# EAGLE design v1 (EAGLE 9.4.1)
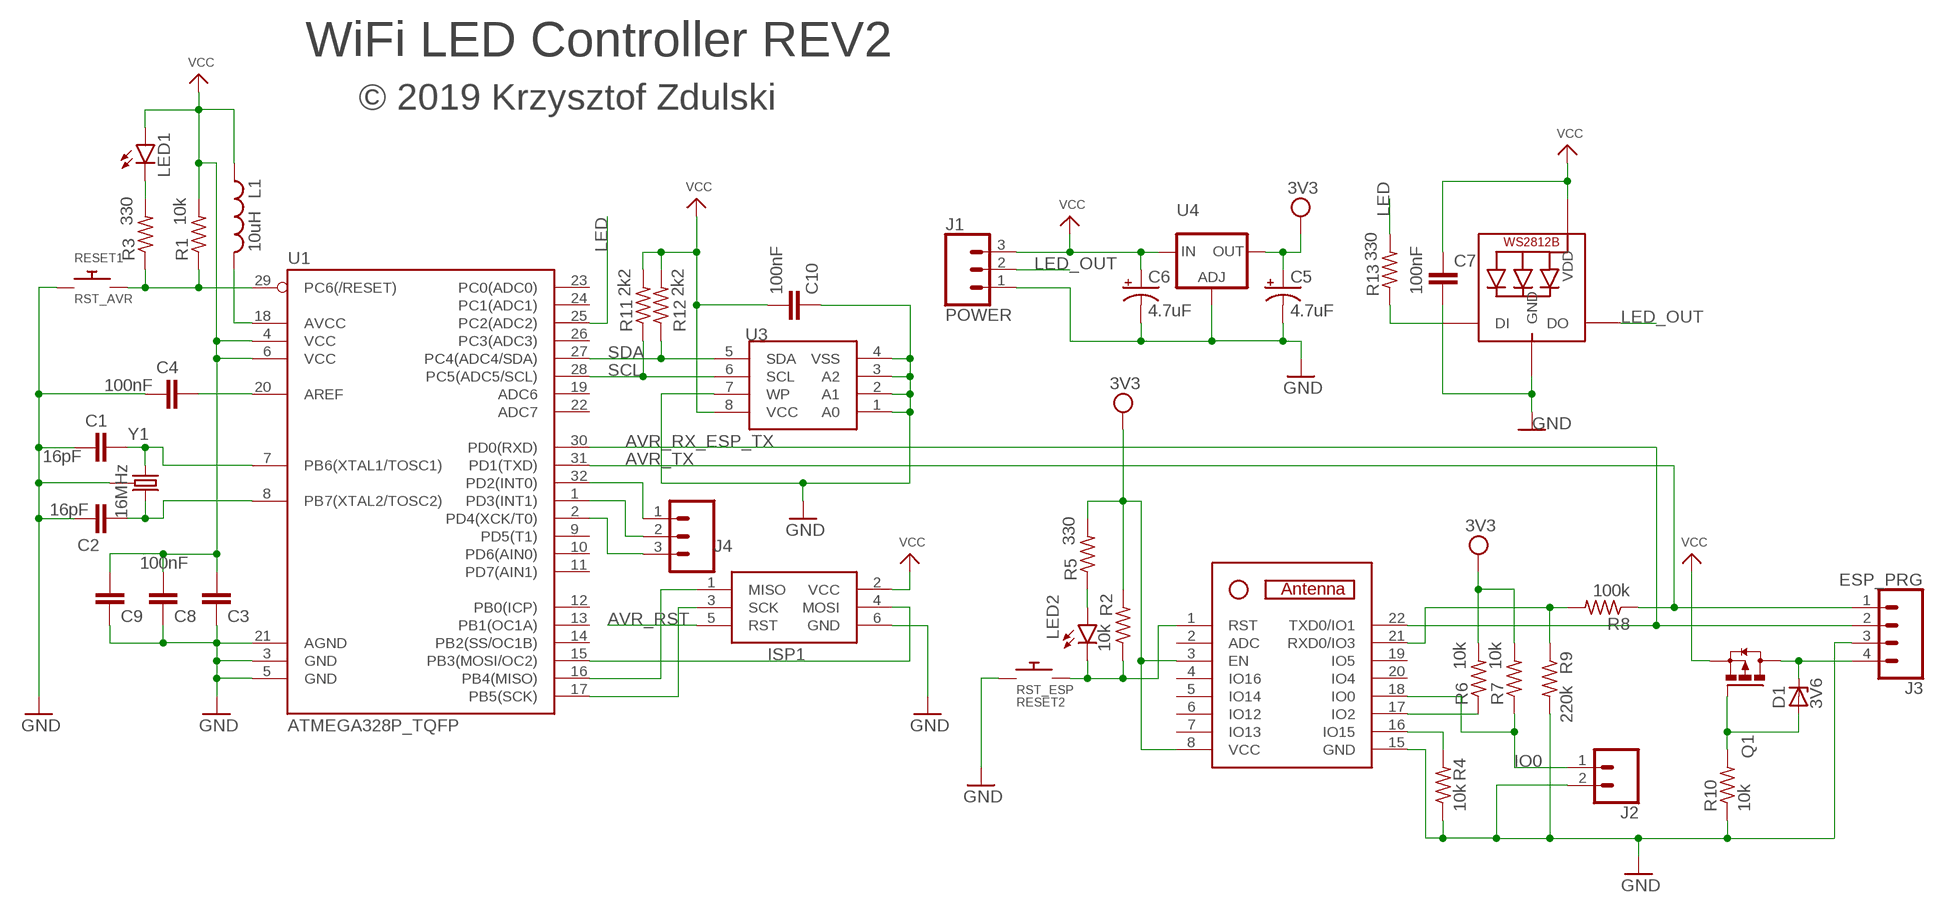
[diagram p0: schematic, sheet 1]

## Parts
C1  16pF  C-EUC0603K  [C0603K]
C2  16pF  C-EUC0603K  [C0603K]
C3  100nF  C-EUC0603  [C0603]
C4  100nF  C-EUC0603  [C0603]
C5  4.7uF  CPOL-US153CLV-0405  [153CLV-0405]
C6  4.7uF  CPOL-US153CLV-0405  [153CLV-0405]
C7  100nF  C-EUC0603  [C0603]
C8  100nF  C-EUC0603  [C0603]
C9  100nF  C-EUC0603  [C0603]
C10  100nF  C-EUC0603  [C0603]
D1  3V6  ZENNER_DIODE  [SOD123]
D2  WS2812B  [WS2812B]
ISP1  AVRISP-6  [AVRISP]
J1  POWER  MX-22-05-3031  [MX-22-05-3031]
J2  CONN_02  [1X02]
J3  ESP_PRG  CONN_04  [1X04]
J4  CONN_03  [1X03]
L1  10uH  L-USL2012C  [L2012C]
LED1  LEDCHIP-LED0603  [CHIP-LED0603]
LED2  LEDCHIP-LED0603  [CHIP-LED0603]
Q1  FDN360P  [SUPER-SOT3]
R1  10k  R-US_R0402  [R0402]
R2  10k  R-US_R0402  [R0402]
R3  330  R-US_R0603  [R0603]
R4  10k  R-US_R0603  [R0603]
R5  330  R-US_R0603  [R0603]
R6  10k  R-US_R0603  [R0603]
R7  10k  R-US_R0603  [R0603]
R8  100k  R-US_R0603  [R0603]
R9  220k  R-US_R0603  [R0603]
R10  10k  R-US_R0402  [R0402]
R11  2k2  R-US_R0603  [R0603]
R12  2k2  R-US_R0603  [R0603]
R13  330  R-US_R0603  [R0603]
RESET1  RST_AVR  BUTTON  [TACTILE_SWITCH_SMD_6.2MM_TALL]
RESET2  RST_ESP  BUTTON  [TACTILE_SWITCH_SMD_6.2MM_TALL]
U1  ATMEGA328P_TQFP  [TQFP32-08]
U2  ESP-07  [ESP-07]
U3  EEPROM-I2CTSSOP8  [TSSOP8]
U4  LD117AS12TR  [SOT223]
Y1  16MHz  CRYSTAL  [CRYSTAL-SMD-3.2X2.5MM]

## Nets
3V3: C5.+ R2.2 R5.2 R6.2 R7.2 U2.3(EN) U2.8(VCC) U4.4(OUT)
AREF: C4.2 U1.20(AREF)
AVCC: L1.2 U1.18(AVCC)
AVR_RST: ISP1.5(RST) R1.1 R3.1 RESET1.B1 RESET1.B2 U1.29(PC6(/RESET))
AVR_RST_LED: LED1.C R3.2
AVR_RX_ESP_TX: J3.2 U1.30(PD0(RXD)) U2.22(TXD0/IO1)
AVR_TX: J3.1 R8.1 U1.31(PD1(TXD))
ESP_RST: LED2.C R2.1 RESET2.B1 RESET2.B2 U2.1(RST)
ESP_RX: R8.2 R9.1 U2.21(RXD0/IO3)
GND: C1.2 C2.2 C3.2 C4.1 C5.- C6.- C7.2 C8.2 C9.2 C10.2 D2.3-GND(GND) ISP1.6(GND) J1.1 J2.2 J3.3 R4.1 R9.2 R10.1 RESET1.A1 RESET1.A2 RESET2.A1 RESET2.A2 U1.3(GND) U1.5(GND) U1.21(AGND) U2.15(GND) U3.1(A0) U3.2(A1) U3.3(A2) U3.4(VSS) U3.7(WP) U4.1(ADJ) Y1.2 Y1.4
IO0: J2.1 R7.1 U2.18(IO0)
IO2: R6.1 U2.17(IO2)
IO15: R4.2 U2.16(IO15)
LED: R13.2 U1.25(PC2(ADC2))
LED_OUT: D2.2-DOUT(DO) J1.2
MISO: ISP1.1(MISO) U1.16(PB4(MISO))
MOSI: ISP1.4(MOSI) U1.15(PB3(MOSI/OC2))
N: D2.4-DIN(DI) R13.1
N$1: LED2.A R5.1
N$18: D1.A Q1.1(G) R10.2
PD2: J4.1 U1.32(PD2(INT0))
PD3: J4.2 U1.1(PD3(INT1))
PD4: J4.3 U1.2(PD4(XCK/T0))
SCK: ISP1.3(SCK) U1.17(PB5(SCK))
SCL: R11.1 U1.28(PC5(ADC5/SCL)) U3.6(SCL)
SDA: R12.1 U1.27(PC4(ADC4/SDA)) U3.5(SDA)
VCC: C3.1 C6.+ C7.1 C8.1 C9.1 C10.1 D2.1-VDD(VDD) ISP1.2(VCC) J1.3 L1.1 LED1.A Q1.2(S) R1.2 R11.2 R12.2 U1.4(VCC) U1.6(VCC) U3.8(VCC) U4.3(IN)
VCC_PRG: D1.C J3.4 Q1.3(D)
XTAL1: C1.1 U1.7(PB6(XTAL1/TOSC1)) Y1.1
XTAL2: C2.1 U1.8(PB7(XTAL2/TOSC2)) Y1.3
Unconnected: U1.9(PD5(T1)) U1.10(PD6(AIN0)) U1.11(PD7(AIN1)) U1.12(PB0(ICP)) U1.13(PB1(OC1A)) U1.14(PB2(SS/OC1B)) U1.19(ADC6) U1.22(ADC7) U1.23(PC0(ADC0)) U1.24(PC1(ADC1)) U1.26(PC3(ADC3)) U2.2(ADC) U2.4(IO16) U2.5(IO14) U2.6(IO12) U2.7(IO13) U2.19(IO5) U2.20(IO4)

## Notes on the sheet
- WiFi LED Controller REV2
- © 2019 Krzysztof Zdulski

## Library data of the parts
C1-C4 C7-C10 = resistor:C-EU: CAPACITOR, European symbol
C5 C6 = resistor:CPOL-US: POLARIZED CAPACITOR, American symbol
D1 = my_parts:ZENNER_DIODE
D2 = my_parts:WS2812B
ISP1 = my_parts:AVRISP: AVR ISP HEADER Standard 6 pin header for AVR programming
J1 = my_parts:MX-22-05-3031
J2 = SparkFun-Connectors:CONN_02: Multi connection point. Often used as Generic Header-pin footprint for 0.1 inch spaced/style header connections On any of the 0.1 inch spaced packages, you can populate with these: Break Away Headers - Straight <https://www.sparkfun.com/products/116> (PRT-00116) Break Away Male Headers - Right Angle <https://www.sparkfun.com/products/553> (PRT-00553) Female Headers <https://www.sparkfun.com/products/115> (PRT-00115) Break Away Headers - Machine Pin <https://www.sparkfun.com/products/117> (PRT-00117) Break Away Female Headers - Swiss Machine Pin <https://www.sparkfun.com/products/743> (PRT-00743) For SCREWTERMINALS and SPRING TERMINALS visit here: Screw Terimnals on SparkFun.com <https://www.sparkfun.com/search/results?term=Screw+Terminals> (5mm/3.5mm/2.54mm spacing) This device is also useful as a general connection point to wire up your design to another part of your project. Our various solder wires solder well into these plated through hole pads. Hook-Up Wire - Assortment (Stranded, 22 AWG) <https://www.sparkfun.com/products/11375> (PRT-11375) Hook-Up Wire - Assortment (Solid Core, 22 AWG) <https://www.sparkfun.com/products/11367> (PRT-11367) View the entire wire category on our website here <https://www.sparkfun.com/categories/141> Special notes: Molex polarized connector foot print use with: PRT-08233 with associated crimp pins and housings. 2.54_SCREWTERM for use with PRT-10571. 3.5mm Screw Terminal footprints for PRT-08084 5mm Screw Terminal footprints for use with PRT-08432
J3 = SparkFun-Connectors:CONN_04: Multi connection point. Often used as Generic Header-pin footprint for 0.1 inch spaced/style header connections On any of the 0.1 inch spaced packages, you can populate with these: Break Away Headers - Straight <https://www.sparkfun.com/products/116> (PRT-00116) Break Away Male Headers - Right Angle <https://www.sparkfun.com/products/553> (PRT-00553) Female Headers <https://www.sparkfun.com/products/115> (PRT-00115) Break Away Headers - Machine Pin <https://www.sparkfun.com/products/117> (PRT-00117) Break Away Female Headers - Swiss Machine Pin <https://www.sparkfun.com/products/743> (PRT-00743) For SCREWTERMINALS and SPRING TERMINALS visit here: Screw Terimnals on SparkFun.com <https://www.sparkfun.com/search/results?term=Screw+Terminals> (5mm/3.5mm/2.54mm spacing) This device is also useful as a general connection point to wire up your design to another part of your project. Our various solder wires solder well into these plated through hole pads. Hook-Up Wire - Assortment (Stranded, 22 AWG) <https://www.sparkfun.com/products/11375> (PRT-11375) Hook-Up Wire - Assortment (Solid Core, 22 AWG) <https://www.sparkfun.com/products/11367> (PRT-11367) View the entire wire category on our website here <https://www.sparkfun.com/categories/141> Special notes: Molex polarized connector foot print use with SKU : PRT-08231 with associated crimp pins and housings. 1MM SMD Version SKU: PRT-10208; PROD_ID: CONN-09696
J4 = SparkFun-Connectors:CONN_03: Multi connection point. Often used as Generic Header-pin footprint for 0.1 inch spaced/style header connections On any of the 0.1 inch spaced packages, you can populate with these: Break Away Headers - Straight <https://www.sparkfun.com/products/116> (PRT-00116) Break Away Male Headers - Right Angle <https://www.sparkfun.com/products/553> (PRT-00553) Female Headers <https://www.sparkfun.com/products/115> (PRT-00115) Break Away Headers - Machine Pin <https://www.sparkfun.com/products/117> (PRT-00117) Break Away Female Headers - Swiss Machine Pin <https://www.sparkfun.com/products/743> (PRT-00743) Stackable Header - 3 Pin (Female, 0.1") <https://www.sparkfun.com/products/13875> (PRT-13875) For SCREWTERMINALS and SPRING TERMINALS visit here: Screw Terimnals on SparkFun.com <https://www.sparkfun.com/search/results?term=Screw+Terminals> (5mm/3.5mm/2.54mm spacing) This device is also useful as a general connection point to wire up your design to another part of your project. Our various solder wires solder well into these plated through hole pads. Hook-Up Wire - Assortment (Stranded, 22 AWG) <https://www.sparkfun.com/products/11375> (PRT-11375) Hook-Up Wire - Assortment (Solid Core, 22 AWG) <https://www.sparkfun.com/products/11367> (PRT-11367) View the entire wire category on our website here <https://www.sparkfun.com/categories/141> Special notes: Molex polarized connector foot print use with SKU : PRT-08232 with associated crimp pins and housings.
L1 = resistor:L-US: INDUCTOR, American symbol
LED1 LED2 = led:LED: LED OSRAM: - CHIPLED LG R971, LG N971, LY N971, LG Q971, LY Q971, LO R971, LY R971 LH N974, LH R974 LS Q976, LO Q976, LY Q976 LO Q996 - Hyper CHIPLED LW Q18S LB Q993, LB Q99A, LB R99A - SideLED LS A670, LO A670, LY A670, LG A670, LP A670 LB A673, LV A673, LT A673, LW A673 LH A674 LY A675 LS A676, LA A676, LO A676, LY A676, LW A676 LS A679, LY A679, LG A679 - Hyper Micro SIDELED® LS Y876, LA Y876, LO Y876, LY Y876 LT Y87S - SmartLED LW L88C, LW L88S LB L89C, LB L89S, LG L890 LS L89K, LO L89K, LY L89K LS L896, LA L896, LO L896, LY L896 - TOPLED LS T670, LO T670, LY T670, LG T670, LP T670 LSG T670, LSP T670, LSY T670, LOP T670, LYG T670 LG T671, LOG T671, LSG T671 LB T673, LV T673, LT T673, LW T673 LH T674 LS T676, LA T676, LO T676, LY T676, LB T676, LH T676, LSB T676, LW T676 LB T67C, LV T67C, LT T67C, LS T67K, LO T67K, LY T67K, LW E67C LS E67B, LA E67B, LO E67B, LY E67B, LB E67C, LV E67C, LT E67C LW T67C LS T679, LY T679, LG T679 LS T770, LO T770, LY T770, LG T770, LP T770 LB T773, LV T773, LT T773, LW T773 LH T774 LS E675, LA E675, LY E675, LS T675 LS T776, LA T776, LO T776, LY T776, LB T776 LHGB T686 LT T68C, LB T68C - Hyper Mini TOPLED® LB M676 - Mini TOPLED Santana® LG M470 LS M47K, LO M47K, LY M47K Source: http://www.osram.convergy.de LUXEON: - LUMILED® LXK2-PW12-R00, LXK2-PW12-S00, LXK2-PW14-U00, LXK2-PW14-V00 LXK2-PM12-R00, LXK2-PM12-S00, LXK2-PM14-U00 LXK2-PE12-Q00, LXK2-PE12-R00, LXK2-PE12-S00, LXK2-PE14-T00, LXK2-PE14-U00 LXK2-PB12-K00, LXK2-PB12-L00, LXK2-PB12-M00, LXK2-PB14-N00, LXK2-PB14-P00, LXK2-PB14-Q00 LXK2-PR12-L00, LXK2-PR12-M00, LXK2-PR14-Q00, LXK2-PR14-R00 LXK2-PD12-Q00, LXK2-PD12-R00, LXK2-PD12-S00 LXK2-PH12-R00, LXK2-PH12-S00 LXK2-PL12-P00, LXK2-PL12-Q00, LXK2-PL12-R00 Source: www.luxeon.com KINGBRIGHT: KA-3528ASYC Source: www.kingbright.com
Q1 = transistor-power:FDN360P: Single P-Channel, PowerTrench (R) MOSFET Source: http://www.fairchildsemi.com/ds/FD/FDN360P.pdf
R1-R13 = resistor:R-US_: RESISTOR, American symbol
RESET1 RESET2 = my_parts:BUTTON
U1 = SparkFun-IC-Microcontroller:ATMEGA328P_TQFP: Popular 328P in QFP Storefront component: ATmega328 - TQFP <https://www.sparkfun.com/products/13448> (COM-13448) Datasheet <http://www.sparkfun.com/datasheets/Components/SMD/ATMega328.pdf> SparkFun Products SparkFun RedBoard - Programmed with Arduino <https://www.sparkfun.com/products/12757> (DEV-12757) Arduino Pro Mini 328 - 5V/16MHz <https://www.sparkfun.com/products/11113> (DEV-11113) Arduino Pro Mini 328 - 3.3V/8MHz <https://www.sparkfun.com/products/11114> (DEV-11114) SparkFun OpenLog <https://www.sparkfun.com/products/13712> (DEV-13712) SparkFun MicroView - OLED Arduino Module <https://www.sparkfun.com/products/12923> (DEV-12923) SparkFun Digital Sandbox <https://www.sparkfun.com/products/12651> (DEV-12651) SparkFun PicoBoard <https://www.sparkfun.com/products/11888> (WIG-11888) Arduino Fio <https://www.sparkfun.com/products/10116> (DEV-10116) LilyPad Arduino 328 Main Board <https://www.sparkfun.com/products/13342> (DEV-13342) SparkFun RedStick <https://www.sparkfun.com/products/13741> (DEV-13741) LilyPad MP3 <https://www.sparkfun.com/products/11013> (DEV-11013) LilyPad Arduino SimpleSnap <https://www.sparkfun.com/products/10941> (DEV-10941) SparkFun Stepoko <https://www.sparkfun.com/products/13899> (ROB-13899) SparkFun Geiger Counter <https://www.sparkfun.com/products/11345> (SEN-11345) SparkFun EL Sequencer <https://www.sparkfun.com/products/12781> (COM-12781) Arduino Pro 328 - 5V/16MHz <https://www.sparkfun.com/products/10915> (DEV-10915) CryptoCape <https://www.sparkfun.com/products/12773> (DEV-12773) SparkFun IR Thermometer Evaluation Board - MLX90614 <https://www.sparkfun.com/products/10740> (SEN-10740) SparkFun RedBot Mainboard <https://www.sparkfun.com/products/12097> (ROB-12097) Arduino Pro 328 - 3.3V/8MHz <https://www.sparkfun.com/products/10914> (DEV-10914) SparkFun Block for Intel® Edison - Arduino <https://www.sparkfun.com/products/13036> (DEV-13036) SparkFun Simon Says - Surface Mount Soldering Kit <https://www.sparkfun.com/products/10935> (KIT-10935) SparkFun 7-Segment Serial Display - Red <https://www.sparkfun.com/products/11441> (COM-11441) SparkFun 7-Segment Serial Display - White <https://www.sparkfun.com/products/11629> (COM-11629) SparkFun 7-Segment Serial Display - Yellow <https://www.sparkfun.com/products/11443> (COM-11443) SparkFun 7-Segment Serial Display - Kelly Green <https://www.sparkfun.com/products/11440> (COM-11440) SparkFun 7-Segment Serial Display - Blue <https://www.sparkfun.com/products/11442> (COM-11442) SparkFun OpenSegment Serial Display - 20mm (Blue) <https://www.sparkfun.com/products/11647> (COM-11647) SparkFun OpenSegment Serial Display - 20mm (Green) <https://www.sparkfun.com/products/11646> (COM-11646) SparkFun OpenSegment Serial Display - 20mm (White) <https://www.sparkfun.com/products/11648> (COM-11648) SparkFun OpenSegment Serial Display - 20mm (Red) <https://www.sparkfun.com/products/11644> (COM-11644) SparkFun OpenSegment Serial Display - 20mm (Yellow) <https://www.sparkfun.com/products/11645> (COM-11645) SparkFun OpenSegment Shield <https://www.sparkfun.com/products/13190> (DEV-13190); PROD_ID: IC-09069
U2 = my_parts:ESP-07
U3 = my_parts:EEPROM-I2C
U4 = v-reg:LD117A?*: Low drop fixed and adjustable positive voltage regulators 1 A Source: http://www.st.com/stonline/products/literature/ds/7194/ld1117axx.pdf
Y1 = my_parts:CRYSTAL

## Board
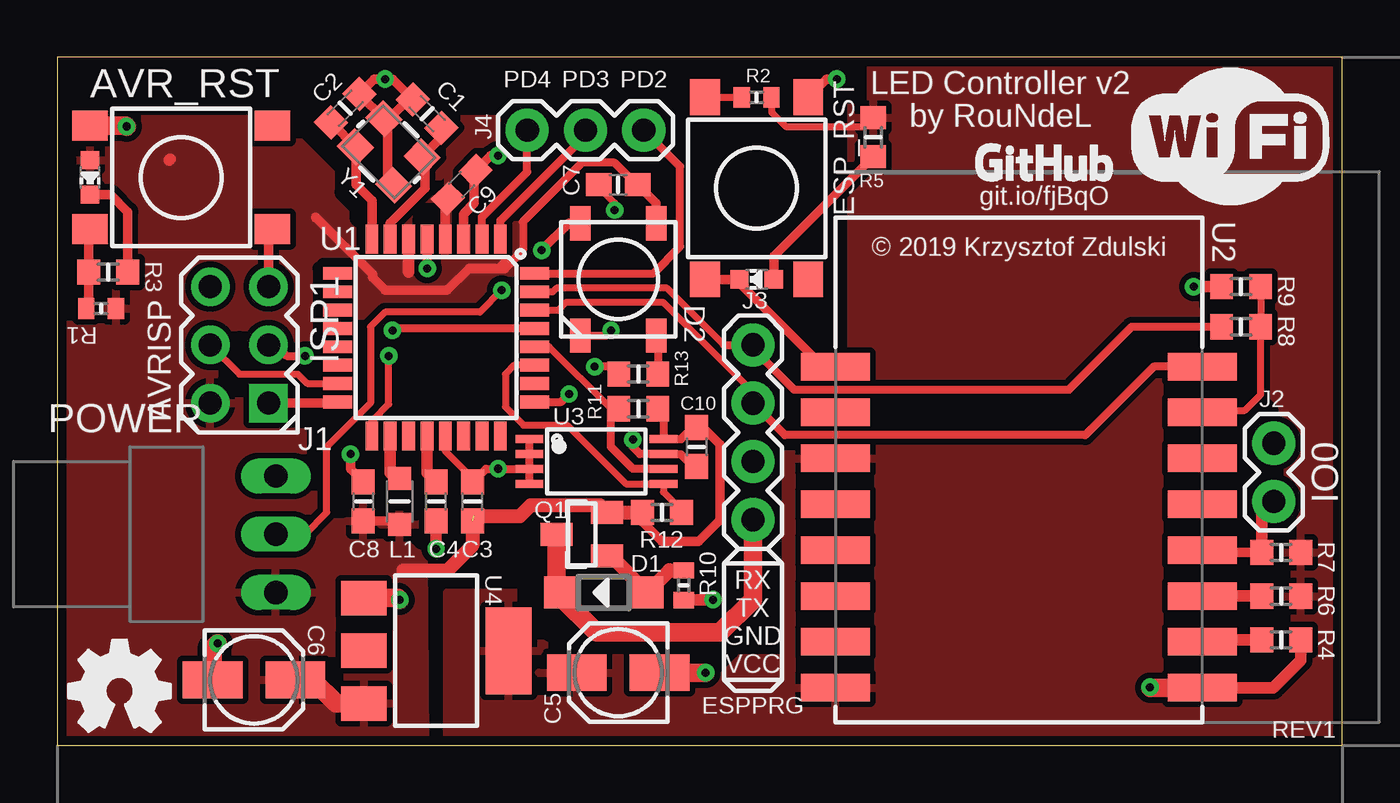
[diagram p1: board, top side]
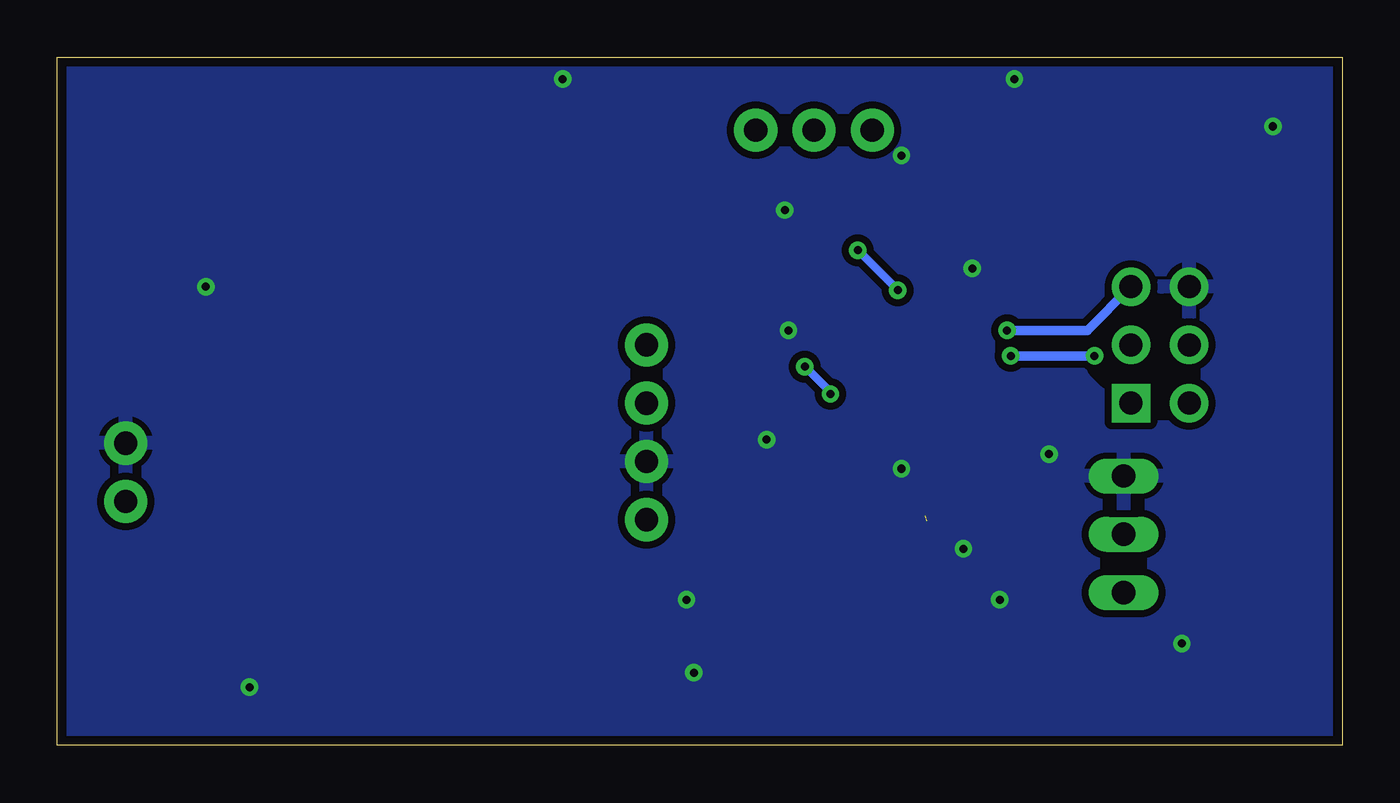
[diagram p2: board, bottom side, seen from below]

Size 56 x 30 mm. Coordinates in mm from the lower left corner, seen from the top.
Outline: 0,0 56,0 56,30 0,30 0,0
Copper layers (1*16): Top 0.035mm / dielectric 1.5mm / Bottom 0.035mm
Design rules "default *": minimum track width 6mil, minimum drill 0.35mm, track to track 6mil, track to pad 8mil, pad to pad 6mil, via to via 6mil, smd to smd 6mil, copper to edge 0.4mm, drill to drill 6mil, minimum pad ring 10mil, minimum via ring 8mil, stop-mask expansion 2mil, vias tented up to drill 24mil, thermal gap 10mil
tRestrict: 75 lines
bRestrict: 1 lines

### Footprints (pad centres in the part's own frame; a part is rotated, then mirrored left to right if it is on the bottom)
C0603K = smd 1.05 x 1.08: 1 -0.875,0; 2 0.875,0
C0603 = smd 1.1 x 1: 1 -0.85,0; 2 0.85,0
153CLV-0405 = smd 2.6 x 1.6: + 1.8,0; - -1.8,0
SOD123 = smd 1.4 x 1.4: A 1.9,0; C -1.9,0
WS2812B = smd 1.5 x 0.9: 1-VDD 2.45,-1.65; 2-DOUT 2.45,1.65; 3-GND -2.45,1.65; 4-DIN -2.45,-1.65
AVRISP = drill 1 pad 1.676 square: 1 -1.27,2.54 | drill 1 pad 1.676: 2 1.27,2.54; 3 -1.27,0; 4 1.27,0; 5 -1.27,-2.54; 6 1.27,-2.54
MX-22-05-3031 = drill 1.016 long: 1 2.54,0; 2 0,0; 3 -2.54,0
1X02 = drill 1.016 pad 1.88: 1 0,0; 2 2.54,0
1X04 = drill 1.016 pad 1.88: 1 0,0; 2 2.54,0; 3 5.08,0; 4 7.62,0
1X03 = drill 1.016 pad 1.88: 1 0,0; 2 2.54,0; 3 5.08,0
L2012C = smd 1 x 1: 1 -1,0; 2 1,0
CHIP-LED0603 = smd 0.8 x 0.8: A 0,-0.75; C 0,0.75
SUPER-SOT3 = smd 1 x 1.4: 1 -0.95,-1.1; 2 0.95,-1.1; 3 0,1.1
R0402 = smd 0.7 x 0.9: 1 -0.65,0; 2 0.65,0
R0603 = smd 1 x 1.1: 1 -0.85,0; 2 0.85,0
TACTILE_SWITCH_SMD_6.2MM_TALL = smd 1.55 x 1.3: A1 -3.975,-2.25; A2 3.975,-2.25; B1 -3.975,2.25; B2 3.975,2.25
TQFP32-08 = smd 1.27 x 0.559: 1 -4.293,2.8; 2 -4.293,2; 3 -4.293,1.2; 4 -4.293,0.4; 5 -4.293,-0.4; 6 -4.293,-1.2; 7 -4.293,-2; 8 -4.293,-2.8; 17 4.293,-2.8; 18 4.293,-2; 19 4.293,-1.2; 20 4.293,-0.4; 21 4.293,0.4; 22 4.293,1.2; 23 4.293,2; 24 4.293,2.8 | smd 0.559 x 1.27: 9 -2.8,-4.293; 10 -2,-4.293; 11 -1.2,-4.293; 12 -0.4,-4.293; 13 0.4,-4.293; 14 1.2,-4.293; 15 2,-4.293; 16 2.8,-4.293; 25 2.8,4.293; 26 2,4.293; 27 1.2,4.293; 28 0.4,4.293; 29 -0.4,4.293; 30 -1.2,4.293; 31 -2,4.293; 32 -2.8,4.293
ESP-07 = smd 3 x 1.2: 1 -8,3.5; 2 -8,1.5; 3 -8,-0.5; 4 -8,-2.5; 5 -8,-4.5; 6 -8,-6.5; 7 -8,-8.5; 8 -8,-10.5; 15 8,-10.5; 16 8,-8.5; 17 8,-6.5; 18 8,-4.5; 19 8,-2.5; 20 8,-0.5; 21 8,1.5; 22 8,3.5
TSSOP8 = smd 0.35 x 1.2: 1 -0.975,-2.925; 2 -0.325,-2.925; 3 0.325,-2.925; 4 0.975,-2.925; 5 0.975,2.925; 6 0.325,2.925; 7 -0.325,2.925; 8 -0.975,2.925
SOT223 = smd 1.5 x 2: 1 -2.3,-3.15; 2 0,-3.15; 3 2.3,-3.15 | smd 3.8 x 2: 4 0,3.15
CRYSTAL-SMD-3.2X2.5MM = smd 1.2 x 1.1: 1 -1.175,-0.875; 2 1.175,-0.875; 3 1.175,0.875; 4 -1.175,0.875

### Placement (x,y rotation side)
C1  16.11,27.54 135 top
C2  12.54,27.78 45 top
C3  18.1,10.64 90 top
C4  16.51,10.64 90 top
C5  24.45,3.17 180 top
C6  8.57,2.86 0 top
C7  24.45,24.45 180 top
C8  13.34,10.64 90 top
C9  17.62,24.45 45 top
C10  27.86,13.02 270 top
D1  23.81,6.67 0 top
D2  24.45,20.32 90 top
ISP1  7.94,17.46 180 top
J1  9.53,9.21 90 top
J2  53.02,10.64 90 top
J3  30.32,17.46 270 top
J4  25.56,26.83 180 top
L1  14.92,10.64 90 top
LED1  1.43,24.77 180 top
LED2  30.48,20.32 90 top
Q1  22.86,9.21 90 top
R1  1.91,19.05 0 top
R2  30.48,28.26 0 top
R3  2.22,20.64 0 top
R4  53.34,4.6 180 top
R5  35.56,26.51 90 top
R6  53.34,6.51 0 top
R7  53.34,8.41 0 top
R8  51.59,18.26 0 top
R9  51.59,20 180 top
R10  27.3,6.99 90 top
R11  25.32,14.68 0 top
R12  26.35,10.16 180 top
R13  25.32,16.19 180 top
RESET1  5.4,24.77 180 top
RESET2  30.48,24.29 90 top
U1  16.51,17.78 270 top
U2  41.91,13.02 0 top
U3  23.5,12.38 270 top
U4  16.51,4.13 270 top
Y1  14.45,25.88 135 top

### Tracks (layer width: path | path; a pad name or v marks a point on that pad's centre or on a via)
3V3
  Top 0.305: R2.2 31.13,27.61 31.75,26.99 35.19,26.99 R5.2
  pour Top (isolate 0.254, rank 3): 16.99,0 16.99,6.67 20,6.67 20,5.14 22.23,3.81 31.75,3.81 31.75,12.7 34.61,12.7 34.61,29.84 55.56,29.84 55.88,30.16 55.88,0
AREF
  Top 0.305: 16.11,13.33 U1.20 | 16.11,11.88 C4.2
  Top 0.508: 16.11,13.33 16.11,11.88
AVCC
  Top 0.508: U1.18 14.51,11.87 L1.2
AVR_RST  (via drill 0.35)
  Top 0.305: 9.21,22.35 RESET1.B1
  Top 0.356: v14.61,18.1 14.69,18.18 U1.29 | 1.37,22.46 RESET1.B2 | 1.37,19.17 R1.1
  Top 0.406: 1.37,22.46 R3.1 1.37,19.17 | ISP1.5 9.21,22.35
  Bottom 0.406: ISP1.5 11.11,18.1 v14.61,18.1
AVR_RST_LED
  Top 0.406: R3.2 3.07,23.26 2.32,24.02 LED1.C
AVR_RX_ESP_TX
  Top 0.305: U1.30 21.84,18.98 22.18,19.32 26.4,19.32 30.32,15.4 J3.2 | U2.22
  Top 0.356: J3.2 31.71,13.53 44.81,13.53 47.78,16.51 U2.22
AVR_TX
  Top 0.305: U1.31 21.6,19.78 21.75,19.94 26.57,19.94 29.05,17.46 | J3.1 30.32,17.3
  Top 0.356: 29.05,17.46 J3.1 | 30.32,17.3 32.11,15.52 44.09,15.52 46.83,18.26 R8.1
ESP_RST
  Top 0.305: RESET2.B2 R2.1
  Top 0.406: RESET2.B1 LED2.C | 33.37,16.52 29.73,20.16
  Top 0.508: 33.59,16.52 U2.1 33.37,16.52 | RESET2.B1 | LED2.C 29.73,20.16
ESP_RX
  Top 0.305: U2.21 50,14.61 51.75,14.61 52.44,15.3 R8.2 R9.1
GND  (via drill 0.35)
  Top 0.305: C7.2 23.6,24.34 24.29,23.65 v24.29,23.34 | 47.65,2.52 v47.62,2.54 | U1.21 16.91,12.83 18.1,11.64 C3.2
  Top 0.356: D2.3-GND 23.9,17.87 v24.13,18.1 | U3.1 U3.2 U3.3 | U3.3 U3.4 | U3.3 | R10.1 27.32,6.35 | v25.08,13.34 25.08,13.02 25.39,12.71 U3.7 27.16,12.71 27.7,12.17 | C3.2 18.68,12.06 v19.21,12.06 U3.3
  Top 0.406: RESET2.A2 33.52,29.05 v33.97,29.05 | C8.2 12.77,12.05 v12.77,12.7 | C1.2 15.4,28.26 | 15.4,28.26 14.61,29.05 v14.29,29.05 13.81,29.05 C2.2 Y1.2 | v19.21,25.72 18.89,25.72 C9.2 18.09,24.92 18.17,24.84 18.17,23.63 17.71,23.18 U1.3 | Y1.2 | Y1.2 14.39,27.33 | 14.39,27.33 14.47,27.33 15.4,28.26 | 14.39,27.33 14.39,24.69 Y1.4 | U1.5 v16.11,20.8 v16.12,20.8 | 27.7,12.17 C10.2
  Top 0.508: C4.1 v16.51,8.57 | R4.1 54.19,3.71 53,2.52 U2.15 | 27.32,6.35 v28.57,6.35 | R9.2 v49.53,20
  Top 0.813: U2.15 47.65,2.52 | U4.1 14.85,6.43 v14.92,6.35 | C6.- 6.77,4.23 v6.99,4.45 | RESET1.A2 2.99,27.02 v3.02,26.99 | C5.- v28.26,3.17
  pour Bottom (isolate 0.305): 0,0 0,30 56,30 56,0
IO0
  Top 0.406: U2.18 50.8,8.41 R7.1
  Top 0.508: J2.1 52.49,10.1 R7.1
IO2
  Top 0.305: R6.1
  Top 0.508: U2.17 R6.1
IO15
  Top 0.508: R4.2 50,4.6 U2.16
LED  (via drill 0.35)
  Top 0.356: U1.25 21.96,14.98 v22.3,15.32 | v23.42,16.52 24.15,16.52 R13.2
  Bottom 0.356: v23.42,16.52 22.3,15.4 v22.3,15.32
LED_OUT  (via drill 0.35)
  Top 0.305: v19.37,19.84 18.41,18.89 14.29,18.89 13.65,18.26 13.65,14.92 11.75,13.02 11.75,10.16 10.79,9.21 10.24,9.21 8.97,9.21
  Top 0.356: J1.2 10.24,9.21
  Top 0.406: v21.11,21.59 22.29,22.77 D2.2-DOUT
  Bottom 0.356: v19.37,19.84 v21.11,21.59
MISO
  Top 0.406: U1.16 12.16,14.92 ISP1.1
MOSI
  Top 0.305: ISP1.4 7.94,16.19 10.48,16.19 10.89,15.78 U1.15
N
  Top 0.356: D2.4-DIN 26.17,17.8 R13.1
N$1
  Top 0.406: LED2.A 31.23,21.33 R5.1
N$18
  Top 0.61: Q1.1 24.12,8.26 D1.A 26.68,7.63 R10.2
PD2
  Top 0.356: U1.32 25.98,20.58 27.15,21.75 27.15,25.24 J4.1
PD3
  Top 0.356: U1.1 19.31,22.88 23.02,26.59 J4.2
PD4
  Top 0.356: U1.2 18.51,23.03 20.48,25 J4.3
SCK  (via drill 0.35)
  Top 0.305: v14.45,16.99 14.45,14.88 13.71,14.15 U1.17
  Top 0.356: ISP1.3 9.53,17.46 10,16.99 v10.79,16.99
  Bottom 0.406: v14.45,16.99 v10.79,16.99
SCL
  Top 0.305: U1.28 21.43,17.38 24.13,14.68
  Top 0.356: U3.6 25.09,12.06 24.13,13.02 24.13,14.68 R11.1
SDA
  Top 0.305: R12.1 27.2,10.26 26.42,11.04 U3.5 24.78,11.41 22.21,13.97 20.32,13.97 19.53,14.76 19.53,16.19 19.91,16.58 U1.27
VCC  (1 unrouted)
  Top 0.356: 26.75,13.36 U3.8 | C7.1 25.24,24.45 24.29,25.4 22.86,25.4 20.29,22.83 20.29,21.6 19.75,21.06 19.47,21.06 19.21,20.8 | U3.8 27.19,13.36 27.7,13.87 | 26.42,14.44 U3.8
  Top 0.406: R12.2 25.5,9.74 26.35,8.89 27.94,8.89 28.89,9.84 28.89,13.12 28.14,13.87 C10.1 27.7,13.87 | D2.1-VDD 26.1,23.65 C7.1 | U1.4 16.91,23.74 C9.1 | C8.1 14.77,9.79 14.88,9.68 | R11.2 26.42,14.44 | 19.75,21.06 19.49,20.8 17.94,20.8 16.99,19.84 14.29,19.84 13.73,20.4 13.73,20.55 11.27,23.02 12.06,22.23
  Top 0.508: U1.6 15.31,20.64 | 4.88,25.52 4.92,25.56
  Top 0.61: 18.15,10 20.16,10 20.64,10.48 23.64,10.48 Q1.2 R12.2 | C3.1 18.1,8.73 16.99,7.62 15.08,7.62 | C6.+ 11.11,2.86
  Top 0.813: J1.3 10.48,6.67 | 14.88,9.68 L1.1 | U4.3 12.14,1.83 11.11,2.86
  pour Top (isolate 0.254, rank 2): 0,0 0,27.34 20,27.34 20,19.37 15.88,19.37 16.04,0
  pour Top (rank 2): 0.64,13.02 2.54,13.02 2.54,5.24 0.64,5.24
VCC_PRG
  Top 0.61: 21.76,6.82 D1.C
  Top 0.813: Q1.3 21.76,6.82 | D1.C 21.91,6.5 23.5,4.92 28.89,4.92 30.32,6.35 J3.4
XTAL1
  Top 0.406: U1.7 14.51,22.77 16.03,24.29 16.03,25.53 Y1.1 16.73,26.5 C1.1
XTAL2
  Top 0.406: U1.8 13.71,23.75 13.02,24.45 13.02,26.07 | Y1.3 | C2.1 13.02,26.07 | 13.02,26.07 | Y1.3 13.02,26.07

### Text on the board
tRestrict: GND LED VCC
tDocu: ESP-12 / Size
_tplace: AVR_RST | PD4 | PD3 | PD2 | LED Controller v2 | by RouNdeL | ESP_RST | git.io/fjBqO | © 2019 Krzysztof Zdulski | AVRISP | IO0 | RX / TX / GND / VCC | ESPPRG | REV1